# EAGLE design Power Management (EAGLE 7.1.0)
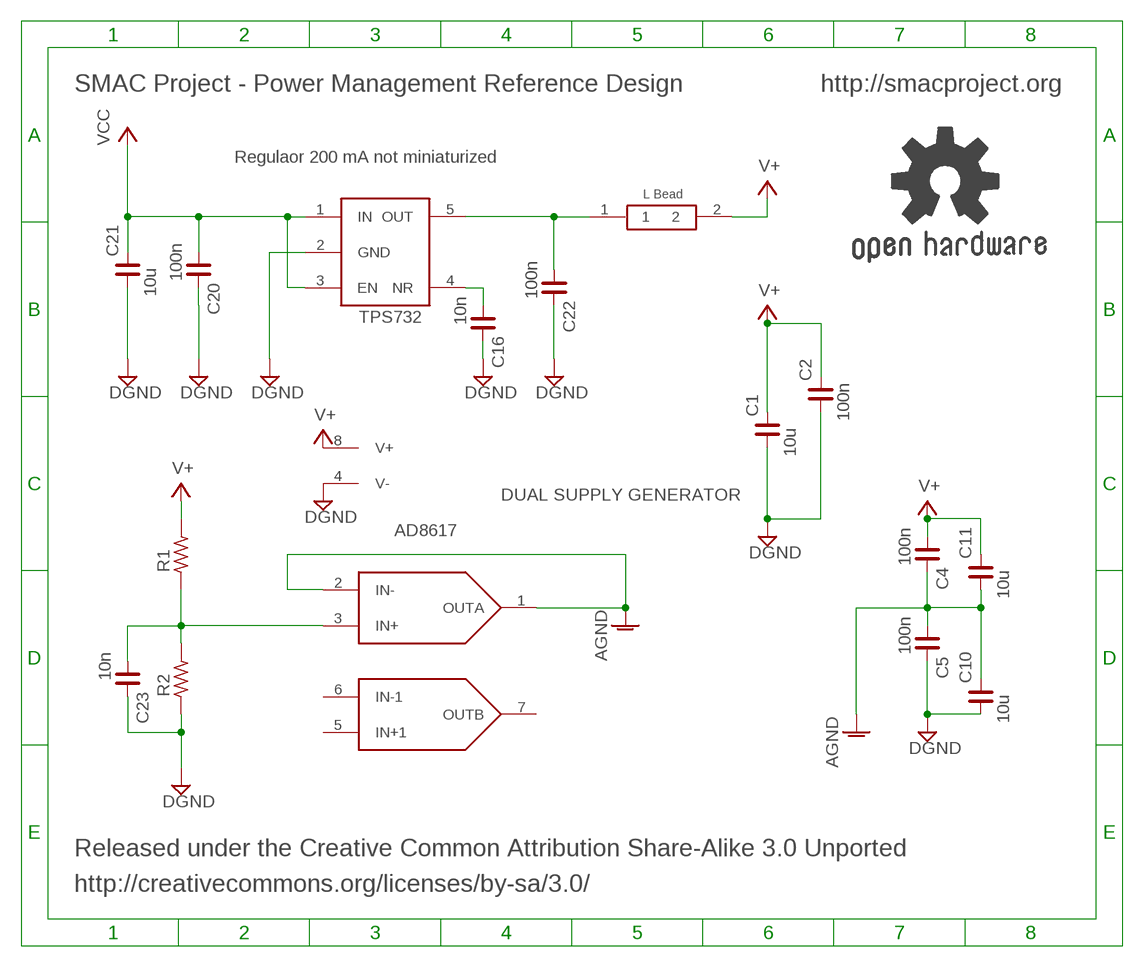
[diagram p0: schematic, sheet 1]

## Parts
C1  10u  C_0402  [C0402]
C2  100n  C_0402  [C0402]
C4  100n  C_0402  [C0402]
C5  100n  C_0402  [C0402]
C10  10u  C_0402  [C0402]
C11  10u  C_0402  [C0402]
C16  10n  C_0402  [C0402]
C20  100n  C_0402  [C0402]
C21  10u  C_0402  [C0402]
C22  100n  C_0402  [C0402]
C23  10n  C_0402  [C0402]
GOLD_ORB_SM1  OSHWLOGO_REF_SM  [OSHW2REF]
IC1  TPS732XX  [SOT23]
IC2  AD8617  [MSOP8]
L-BEAD  L-BEAD  [0402]
R1  R_0402  [R0402]
R2  R_0402  [R0402]

## Nets
AGND: C4.2 C5.1 C10.2 C11.1 IC2.1(OUTA) IC2.2(IN-)
DGND: C1.1 C2.1 C5.2 C10.1 C16.2 C20.2 C21.1 C22.2 C23.2 IC1.2(GND) IC2.4(V-) R2.1
N$2: C23.1 IC2.3(IN+) R1.1 R2.2
N$20: C16.1 IC1.4(NR)
N$21: C22.1 IC1.5(OUT) L-BEAD.1
V+: C1.2 C2.2 C4.1 C11.2 IC2.8(V+) L-BEAD.2 R1.2
VCC: C20.1 C21.2 IC1.1(IN) IC1.3(EN)
Unconnected: IC2.5(IN+1) IC2.6(IN-1) IC2.7(OUTB)

## Notes on the sheet
- SMAC Project - Power Management Reference Design | http://smacproject.org
- Regulaor 200 mA not miniaturized
- DUAL SUPPLY GENERATOR
- Released under the Creative Common Attribution Share-Alike 3.0 Unported
- http://creativecommons.org/licenses/by-sa/3.0/

## Library data of the parts
C1 C2 C4 C5 C10 C11 C16 C20-C23 = rc-master-smd:C_: NON-POLARIZED CAP
GOLD_ORB_SM1 = bfl:OSHWLOGO: These are Open-Source Hardware logos.
IC1 = TPS732xx:TPS732XX
IC2 = ad8617:AD8617
L-BEAD = L-Bead:L-BEAD
R1 R2 = rc-master-smd:R_: RESISTOR

## Board
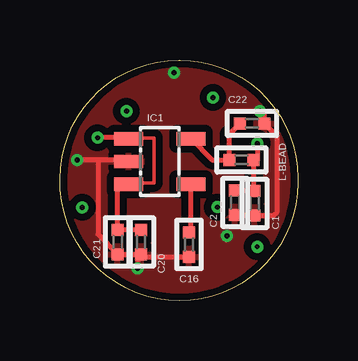
[diagram p1: board, top side]
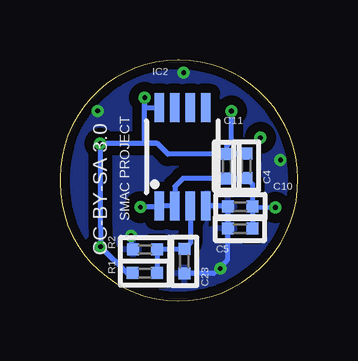
[diagram p2: board, bottom side, seen from below]

Size 9.93 x 10.06 mm. Coordinates in mm from the lower left corner, seen from the top.
Outline: 5,10.05 arc-90 5.01,10.06
Outline: 0,5.09 arc-90 4.97,10.05 5,10.05 arc-90 9.93,5.13 9.93,4.93 arc-90 5,0 arc-91 0,5.1
Copper layers (1*16): Top 0.035mm / dielectric 1.5mm / Bottom 0.035mm
Design rules "2_def": minimum track width 0.1mm, minimum drill 0.1mm, track to track 0.15mm, track to pad 0.15mm, pad to pad 0.15mm, via to via 0.15mm, smd to smd 0mil, copper to edge 0.25mm, drill to drill 0.25mm, minimum pad ring 0.1mm, minimum via ring 0.1mm, stop-mask expansion 0mil, vias tented up to drill 0.0025mm, thermal gap 10mil

### Footprints (pad centres in the part's own frame; a part is rotated, then mirrored left to right if it is on the bottom)
C0402 = smd 0.5 x 0.5: 1 -0.508,0; 2 0.508,0
SOT23 = smd 0.55 x 1.2: 1 -0.95,-1.3; 2 0,-1.3; 3 0.95,-1.3; 4 0.95,1.3; 5 -0.95,1.3
MSOP8 = smd 0.4 x 1.2: 1 -0.975,-2.05; 2 -0.325,-2.05; 3 0.325,-2.05; 4 0.975,-2.05; 5 0.975,2.05; 6 0.325,2.05; 7 -0.325,2.05; 8 -0.975,2.05
0402 = smd 0.5 x 0.5: 1 -0.508,0; 2 0.508,0
R0402 = smd 0.5 x 0.5: 1 -0.508,0; 2 0.508,0

### Placement (x,y rotation side)
C1  8.12,4.07 90 top
C2  7.31,4.1 90 top
C4  2.15,5.63 270 bottom
C5  2.41,3.01 180 bottom
C10  2.4,3.94 0 bottom
C11  2.96,5.62 90 bottom
C16  5.39,2.35 270 top
C20  3.39,2.46 270 top
C21  2.41,2.46 90 top
C22  8.02,7.4 0 top
C23  4.73,1.65 270 bottom
GOLD_ORB_SM1  11.68,1.52 0 top
IC1  4.16,5.82 270 top
IC2  4.81,6.01 0 bottom
L-BEAD  7.57,5.89 0 top
R1  6.39,1.16 180 bottom
R2  6.38,2.15 0 bottom

### Tracks (layer width: path | path; a pad name or v marks a point on that pad's centre or on a via)
AGND  (via drill 0.2 pad 0.5)
  Bottom 0.2: C10.2 1.9,3.92 v0.93,3.9 | C10.2 1.89,4.87 C4.2 2.17,5.11 C11.1 4.79,5.11 5.13,4.78 5.13,3.97 IC2.2 IC2.1 5.84,3.91 v6.57,3.91 | C10.2 C5.1
DGND  (via drill 0.2 pad 0.5)
  Top 0.2: 1.59,5.87 2.86,5.87 IC1.2 | 1.59,5.87 v0.72,5.87 | C20.2 C21.1 1.59,2.78 1.59,5.87 | C20.2 3.49,1.85 C16.2 | C20.2 3.23,1.8 v3.24,1.35 | v8.35,7.93 8.52,7.76 C22.2 9.06,6.86 9.06,3.72 8.91,3.56 C1.1 7.34,3.56 C2.1 | v6.96,2.71 6.94,2.53 6.93,2.53
  Bottom 0.2: 2.92,3.92 C10.1 | 2.92,3.92 C5.2 2.92,1.73 v3.24,1.35 3.5,1.15 C23.2 | 2.92,3.92 2.96,3.96 IC2.4 | R2.1 6.96,2.23 v6.96,2.71
  other vias: 4.76,9.53
  pour Bottom (isolate 0.4): -0.04,5.15 arc-90 4.86,10.05 5.16,10.05 arc-90 9.99,5.22 9.99,4.8 arc-97 4.65,0.06 arc-82 -0.03,5.18
  pour Top (isolate 0.3): -0.02,5.16 arc-90 4.89,10.07 5.18,10.07 arc-90 10.01,5.23 10.01,4.82 arc-97 4.68,0.07 arc-82 -0.01,5.2
N$2
  Bottom 0.2: R1.1 5.87,1.18 R2.2 4.74,2.15 C23.1 4.49,2.41 IC2.3
N$20
  Top 0.2: C16.1 5.46,2.94 IC1.4
N$21
  Top 0.2: IC1.5 6.34,5.89 L-BEAD.1 7.07,6.96 C22.1
V+  (via drill 0.2 pad 0.5)
  Top 0.2: C2.2 7.34,4.58 C1.2 8.22,4.68 8.08,4.68 L-BEAD.2 8.24,5.89 v8.24,6.57 8.22,6.55
  Bottom 0.2: 2.17,6.12 C4.1 2.94,6.14 C11.2 | 5.88,6.58 5.42,6.12 C11.2 | 5.88,6.58 5.88,6.57 v8.24,6.57 8.24,3.08 8.23,3.07 v8.23,2.26 7.13,1.16 R1.2 | 5.88,6.58 6.39,6.58 v6.39,8.49 6.39,8.06 IC2.8 | v2.78,7.92 2.76,6.72 2.76,6.67 2.96,6.47 C11.2
VCC  (via drill 0.2 pad 0.5)
  Top 0.15: 2.86,4.93 3.92,4.93 3.92,6.8 2.86,6.8 IC1.1
  Top 0.2: C20.1 C21.2 2.41,4.87 IC1.3 2.86,4.93 | v1.57,6.81 2.86,6.81 IC1.1

### Text on the board
bPlace: SMAC PROJECT | CC-BY-SA 3.0
Reference: http://smacproject.org